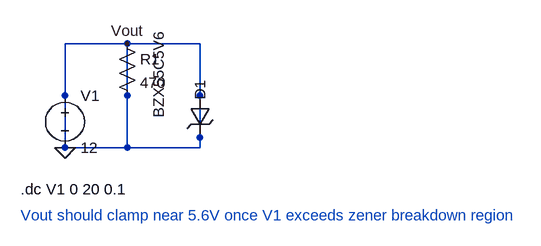
[diagram p0: schematic 08_zener_regulator.asc]
08_zener_regulator.asc, the LTspice schematic file:
Version 4
SHEET 1 880 680
WIRE 224 96 128 96
WIRE 336 96 224 96
WIRE 128 176 128 96
WIRE 224 176 224 96
WIRE 336 176 336 96
WIRE 128 256 128 176
WIRE 224 256 224 176
WIRE 224 256 128 256
WIRE 336 256 336 176
WIRE 336 256 224 256
FLAG 128 256 0
FLAG 224 96 Vout
SYMBOL voltage 128 160 R0
SYMATTR InstName V1
SYMATTR Value 12
SYMBOL res 208 80 R0
SYMATTR InstName R1
SYMATTR Value 470
SYMBOL zener 320 176 R0
WINDOW 0 32 -8 VBottom 2
WINDOW 3 -32 -32 VBottom 2
SYMATTR InstName D1
SYMATTR Value BZX55C5V6
TEXT 60 320 Left 2 !.dc V1 0 20 0.1
TEXT 60 360 Left 2 ;Vout should clamp near 5.6V once V1 exceeds zener breakdown region

The netlist it stands for:
* 08_zener_regulator.asc
V1 0 0 12
R1 0 0 470
D1 0 0 BZX55C5V6
.model D D
.lib standard.dio
.dc V1 0 20 0.1
* Vout should clamp near 5.6V once V1 exceeds zener breakdown region
.backanno
.end